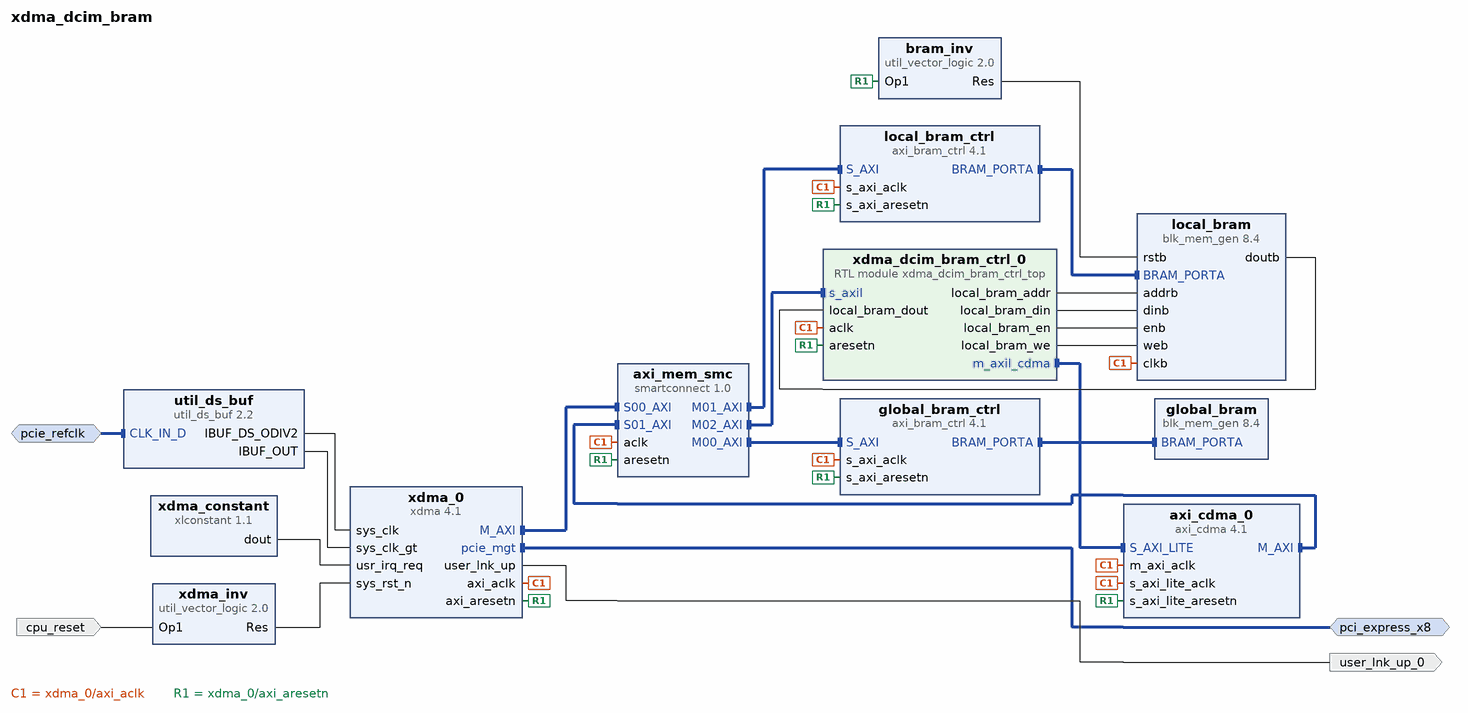
[diagram p0: block diagram of the top level]
# Vivado block design xdma_dcim_bram, xcvu37p-fsvh2892-2L-e, Vivado 2024.2.2
create_bd_design xdma_dcim_bram

create_bd_intf_port -mode Master -vlnv xilinx.com:interface:pcie_7x_mgt_rtl:1.0 pci_express_x8
create_bd_intf_port -mode Slave -vlnv xilinx.com:interface:diff_clock_rtl:1.0 pcie_refclk
set_property -dict {CONFIG.FREQ_HZ 100000000} [get_bd_intf_ports pcie_refclk]
create_bd_port -dir O user_lnk_up_0
create_bd_port -dir I -type rst cpu_reset
set_property -dict {CONFIG.POLARITY ACTIVE_HIGH} [get_bd_ports cpu_reset]

create_bd_cell -type module -reference xdma_dcim_bram_ctrl_top xdma_dcim_bram_ctrl_0
create_bd_cell -type ip -vlnv xilinx.com:ip:xdma:4.1 xdma_0
set_property -dict [list \
  CONFIG.PCIE_BOARD_INTERFACE pci_express_x8 \
  CONFIG.axi_data_width 256_bit \
  CONFIG.axilite_master_en false \
  CONFIG.axisten_freq 250 \
  CONFIG.cfg_mgmt_if false \
  CONFIG.en_ext_ch_gt_drp false \
  CONFIG.en_pcie_drp false \
  CONFIG.en_transceiver_status_ports false \
  CONFIG.enable_jtag_dbg false \
  CONFIG.mode_selection Advanced \
  CONFIG.pcie_extended_tag true \
  CONFIG.pf0_device_id 9024 \
  CONFIG.pf0_interrupt_pin NONE \
  CONFIG.pf0_msix_cap_pba_bir BAR_1:0 \
  CONFIG.pf0_msix_cap_pba_offset 00008FE0 \
  CONFIG.pf0_msix_cap_table_bir BAR_1:0 \
  CONFIG.pf0_msix_cap_table_offset 00008000 \
  CONFIG.pf0_msix_cap_table_size 01F \
  CONFIG.pf0_msix_enabled true \
  CONFIG.pipe_sim false \
  CONFIG.pl_link_cap_max_link_speed 8.0_GT/s \
  CONFIG.plltype QPLL1 \
  CONFIG.xdma_axi_intf_mm AXI_Memory_Mapped \
  CONFIG.xdma_pcie_64bit_en true \
  CONFIG.xdma_rnum_chnl 4 \
  CONFIG.xdma_wnum_chnl 4 \
] [get_bd_cells xdma_0]
create_bd_cell -type ip -vlnv xilinx.com:ip:xlconstant:1.1 xdma_constant
set_property -dict {CONFIG.CONST_VAL 0} [get_bd_cells xdma_constant]
create_bd_cell -type ip -vlnv xilinx.com:ip:util_vector_logic:2.0 xdma_inv
set_property -dict {CONFIG.C_OPERATION not CONFIG.C_SIZE 1} [get_bd_cells xdma_inv]
create_bd_cell -type ip -vlnv xilinx.com:ip:axi_bram_ctrl:4.1 global_bram_ctrl
set_property -dict {CONFIG.DATA_WIDTH 256 CONFIG.SINGLE_PORT_BRAM 1} [get_bd_cells global_bram_ctrl]
create_bd_cell -type ip -vlnv xilinx.com:ip:blk_mem_gen:8.4 global_bram
set_property -dict [list \
  CONFIG.EN_SAFETY_CKT false \
  CONFIG.Memory_Type Single_Port_RAM \
  CONFIG.Read_Width_A 256 \
  CONFIG.Write_Width_A 256 \
  CONFIG.use_bram_block BRAM_Controller \
] [get_bd_cells global_bram]
create_bd_cell -type ip -vlnv xilinx.com:ip:axi_bram_ctrl:4.1 local_bram_ctrl
set_property -dict {CONFIG.DATA_WIDTH 256 CONFIG.SINGLE_PORT_BRAM 1} [get_bd_cells local_bram_ctrl]
create_bd_cell -type ip -vlnv xilinx.com:ip:blk_mem_gen:8.4 local_bram
set_property -dict [list \
  CONFIG.Assume_Synchronous_Clk true \
  CONFIG.EN_SAFETY_CKT false \
  CONFIG.Memory_Type True_Dual_Port_RAM \
  CONFIG.Read_Width_A 256 \
  CONFIG.Read_Width_B 256 \
  CONFIG.Write_Width_A 256 \
  CONFIG.Write_Width_B 256 \
  CONFIG.use_bram_block BRAM_Controller \
] [get_bd_cells local_bram]
create_bd_cell -type ip -vlnv xilinx.com:ip:util_vector_logic:2.0 bram_inv
set_property -dict {CONFIG.C_OPERATION not CONFIG.C_SIZE 1} [get_bd_cells bram_inv]
create_bd_cell -type ip -vlnv xilinx.com:ip:axi_cdma:4.1 axi_cdma_0
set_property -dict [list \
  CONFIG.C_ADDR_WIDTH 32 \
  CONFIG.C_INCLUDE_DRE 1 \
  CONFIG.C_INCLUDE_SG 0 \
  CONFIG.C_M_AXI_DATA_WIDTH 256 \
] [get_bd_cells axi_cdma_0]
create_bd_cell -type ip -vlnv xilinx.com:ip:util_ds_buf:2.2 util_ds_buf
set_property -dict {CONFIG.DIFF_CLK_IN_BOARD_INTERFACE pcie_refclk CONFIG.USE_BOARD_FLOW true} [get_bd_cells util_ds_buf]
create_bd_cell -type ip -vlnv xilinx.com:ip:smartconnect:1.0 axi_mem_smc
set_property -dict {CONFIG.NUM_MI 3 CONFIG.NUM_SI 2} [get_bd_cells axi_mem_smc]

# ---- connections ----

connect_bd_intf_net [get_bd_intf_pins axi_cdma_0/M_AXI] [get_bd_intf_pins axi_mem_smc/S01_AXI]
connect_bd_intf_net [get_bd_intf_pins axi_mem_smc/M00_AXI] [get_bd_intf_pins global_bram_ctrl/S_AXI]
connect_bd_intf_net [get_bd_intf_pins axi_mem_smc/M01_AXI] [get_bd_intf_pins local_bram_ctrl/S_AXI]
connect_bd_intf_net [get_bd_intf_pins axi_mem_smc/M02_AXI] [get_bd_intf_pins xdma_dcim_bram_ctrl_0/s_axil]
connect_bd_intf_net [get_bd_intf_pins global_bram/BRAM_PORTA] [get_bd_intf_pins global_bram_ctrl/BRAM_PORTA]
connect_bd_intf_net [get_bd_intf_pins local_bram/BRAM_PORTA] [get_bd_intf_pins local_bram_ctrl/BRAM_PORTA]
connect_bd_intf_net [get_bd_intf_ports pcie_refclk] [get_bd_intf_pins util_ds_buf/CLK_IN_D]
connect_bd_intf_net [get_bd_intf_pins xdma_0/M_AXI] [get_bd_intf_pins axi_mem_smc/S00_AXI]
connect_bd_intf_net [get_bd_intf_ports pci_express_x8] [get_bd_intf_pins xdma_0/pcie_mgt]
connect_bd_intf_net [get_bd_intf_pins xdma_dcim_bram_ctrl_0/m_axil_cdma] [get_bd_intf_pins axi_cdma_0/S_AXI_LITE]
connect_bd_net [get_bd_pins bram_inv/Res] [get_bd_pins local_bram/rstb]
connect_bd_net [get_bd_ports cpu_reset] [get_bd_pins xdma_inv/Op1]
connect_bd_net [get_bd_pins local_bram/doutb] [get_bd_pins xdma_dcim_bram_ctrl_0/local_bram_dout]
connect_bd_net [get_bd_pins util_ds_buf/IBUF_DS_ODIV2] [get_bd_pins xdma_0/sys_clk]
connect_bd_net [get_bd_pins util_ds_buf/IBUF_OUT] [get_bd_pins xdma_0/sys_clk_gt]
connect_bd_net [get_bd_pins xdma_0/axi_aclk] \
  [get_bd_pins axi_mem_smc/aclk] [get_bd_pins global_bram_ctrl/s_axi_aclk] [get_bd_pins local_bram_ctrl/s_axi_aclk] \
  [get_bd_pins axi_cdma_0/m_axi_aclk] [get_bd_pins axi_cdma_0/s_axi_lite_aclk] [get_bd_pins local_bram/clkb] \
  [get_bd_pins xdma_dcim_bram_ctrl_0/aclk]
connect_bd_net [get_bd_pins xdma_0/axi_aresetn] \
  [get_bd_pins axi_mem_smc/aresetn] [get_bd_pins global_bram_ctrl/s_axi_aresetn] [get_bd_pins local_bram_ctrl/s_axi_aresetn] \
  [get_bd_pins axi_cdma_0/s_axi_lite_aresetn] [get_bd_pins bram_inv/Op1] [get_bd_pins xdma_dcim_bram_ctrl_0/aresetn]
connect_bd_net [get_bd_pins xdma_0/user_lnk_up] [get_bd_ports user_lnk_up_0]
connect_bd_net [get_bd_pins xdma_constant/dout] [get_bd_pins xdma_0/usr_irq_req]
connect_bd_net [get_bd_pins xdma_dcim_bram_ctrl_0/local_bram_addr] [get_bd_pins local_bram/addrb]
connect_bd_net [get_bd_pins xdma_dcim_bram_ctrl_0/local_bram_din] [get_bd_pins local_bram/dinb]
connect_bd_net [get_bd_pins xdma_dcim_bram_ctrl_0/local_bram_en] [get_bd_pins local_bram/enb]
connect_bd_net [get_bd_pins xdma_dcim_bram_ctrl_0/local_bram_we] [get_bd_pins local_bram/web]
connect_bd_net [get_bd_pins xdma_inv/Res] [get_bd_pins xdma_0/sys_rst_n]

# ---- address map ----
assign_bd_address -offset 0x10000000 -range 64K -target_address_space [get_bd_addr_spaces axi_cdma_0/Data] [get_bd_addr_segs global_bram_ctrl/S_AXI/Mem0]
assign_bd_address -offset 0x10010000 -range 64K -target_address_space [get_bd_addr_spaces axi_cdma_0/Data] [get_bd_addr_segs local_bram_ctrl/S_AXI/Mem0]
exclude_bd_addr_seg -offset 0x00000000 -range 4K -target_address_space [get_bd_addr_spaces axi_cdma_0/Data] [get_bd_addr_segs xdma_dcim_bram_ctrl_0/s_axil/reg0]
assign_bd_address -offset 0x0000000010000000 -range 64K -target_address_space [get_bd_addr_spaces xdma_0/M_AXI] [get_bd_addr_segs global_bram_ctrl/S_AXI/Mem0]
assign_bd_address -offset 0x0000000010010000 -range 64K -target_address_space [get_bd_addr_spaces xdma_0/M_AXI] [get_bd_addr_segs local_bram_ctrl/S_AXI/Mem0]
assign_bd_address -offset 0x0000000010020000 -range 4K -target_address_space [get_bd_addr_spaces xdma_0/M_AXI] [get_bd_addr_segs xdma_dcim_bram_ctrl_0/s_axil/reg0]
assign_bd_address -offset 0x00000000 -range 64K -target_address_space [get_bd_addr_spaces xdma_dcim_bram_ctrl_0/m_axil_cdma] [get_bd_addr_segs axi_cdma_0/S_AXI_LITE/Reg]

validate_bd_design
save_bd_design
